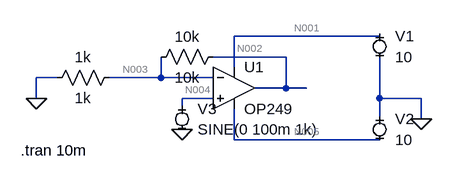
[diagram p0: schematic 2_неінвертуючий підс.asc]
* 2_неінвертуючий підс.asc
* U1: OP249 (symbol EXTRA\AudioOpamp\AD\OP249 not available, pins judged from their places): In+=N004 In-=N003 V+=N001 V-=N005 OUT=N002
V1 N001 0 10
V2 0 N005 10
R§10k N002 N003 10k
R§1k N003 0 1k
V3 N004 0 SINE(0 100m 1k)
.tran 10m
.backanno
.end

* Results of the author's LTspice run, read from the files saved beside the schematic
* Operating Point, zero values left out:
*   V(n003) = 200 µV
*   V(n005) = -10 V
*   V(n001) = 10 V
*   V(n002) = 2.201 mV
*   I(1k) = 200 nA
*   I(10k) = 200.1 nA
*   I(V3) = -74.02 pA
*   I(V2) = -2.628 mA
*   I(V1) = -2.628 mA
*   Ix(u1:1) = 74.02 pA
*   Ix(u1:2) = 68.02 pA
*   Ix(u1:99) = 2.628 mA
*   Ix(u1:50) = -2.628 mA
*   Ix(u1:30) = -200.1 nA
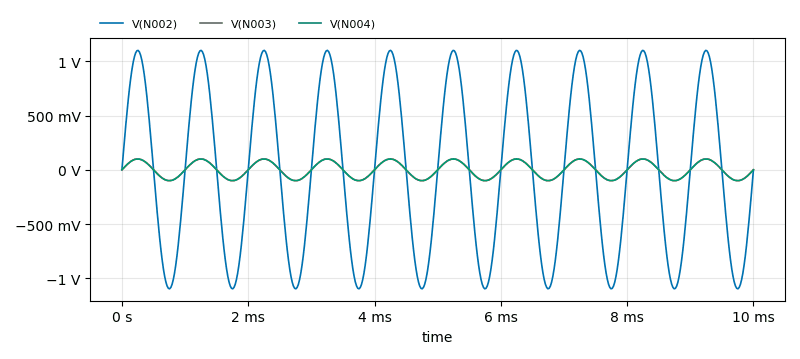
[diagram p1: Transient Analysis of 2_неінвертуючий підс.asc, plotted from the saved traces]
* Transient Analysis, 1 run:
*   V(N002): min -1.096 V, max 1.101 V, average 2.2 mV, rms 777.1 mV, last 213.1 µV
*   V(N003): min -99.67 mV, max 100.1 mV, average 199.9 µV, rms 70.64 mV, last 19.31 µV
*   V(N004): min -99.87 mV, max 99.88 mV, average -69.76 nV, rms 70.64 mV, last 0 V